# Altium schematic sheet EPS_Battery_Heaters-Control.SchDoc: Battery / Heaters Control
size A4
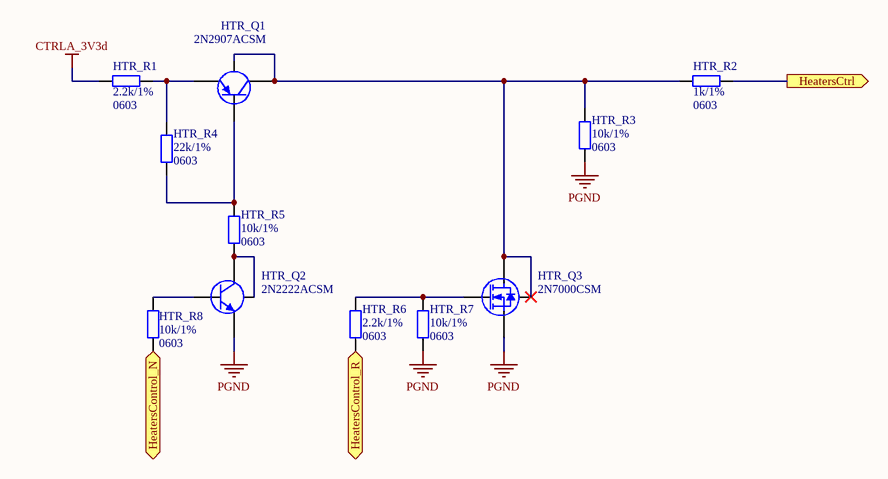
[diagram p0: EPS_Battery_Heaters-Control.SchDoc]

## Parts
HTR_Q1  2N2907ACSM  [LCC1-4_BEC]
HTR_Q2  2N2222ACSM  [LCC1-4_BEC]
HTR_Q3  2N7000CSM  [LCC1-4_GSD]
HTR_R1  Package: 0603  [SMD_Resistor_0603]  (hidden comment: 2.2k/1%)
HTR_R2  Package: 0603  [SMD_Resistor_0603]  (hidden comment: 1k/1%)
HTR_R3  Package: 0603  [SMD_Resistor_0603]  (hidden comment: 10k/1%)
HTR_R4  Package: 0603  [SMD_Resistor_0603]  (hidden comment: 22k/1%)
HTR_R5  Package: 0603  [SMD_Resistor_0603]  (hidden comment: 10k/1%)
HTR_R6  Package: 0603  [SMD_Resistor_0603]  (hidden comment: 2.2k/1%)
HTR_R7  Package: 0603  [SMD_Resistor_0603]  (hidden comment: 10k/1%)
HTR_R8  Package: 0603  [SMD_Resistor_0603]  (hidden comment: 10k/1%)

## Ports
HeatersControl_N (in), HeatersControl_R (in), HeatersCtrl (out)

## Nets
CTRLA_3V3d: HTR_R1.2
PGND: HTR_Q2.E HTR_Q3.S HTR_R3.1 HTR_R7.1
HeatersControl_N: HTR_R8.2 ; port HeatersControl_N
HeatersControl_R: HTR_R6.1 ; port HeatersControl_R
HeatersCtrl: HTR_R2.1 ; port HeatersCtrl
NetHTR_Q1_B: HTR_Q1.B HTR_R4.1 HTR_R5.2
NetHTR_Q1_C: HTR_Q1.C HTR_Q1.Shield HTR_Q3.D HTR_Q3.Shield HTR_R2.2 HTR_R3.2
NetHTR_Q1_E: HTR_Q1.E HTR_R1.1 HTR_R4.2
NetHTR_Q2_B: HTR_Q2.B HTR_R8.1
NetHTR_Q2_C: HTR_Q2.C HTR_Q2.Shield HTR_R5.1
NetHTR_Q3_G: HTR_Q3.G HTR_R6.2 HTR_R7.2

## Notes on the sheet
- Title:
- Project:
- Author:
- Model:
- Document Number:
- Checked by:
- Rev:
- Date:
- Approved by:
- Sheet:
- of
- File name:

## Library data of the parts
HTR_Q1 = 2N2907ACSM: Silicon Planar Epitaxial PNP Transistor.; Manufacturer: Semelab-TT; Value: 2N2907ACSM
HTR_Q2 = 2N2222ACSM: Silicon Planar Epitaxial NPN Transistor.; Manufacturer: Semelab-TT; Value: 2N2222ACSM
HTR_Q3 = 2N7000CSM: N-Channel Enhancement Mode MOS Transistor.; Manufacturer: Semelab-TT; Value: 2N7000CSM
HTR_R1-HTR_R8 = Res
  HTR_R1 HTR_R6: Value: 2.2k/1%
  HTR_R2: Value: 1k/1%
  HTR_R3 HTR_R5 HTR_R7 HTR_R8: Value: 10k/1%
  HTR_R4: Value: 22k/1%